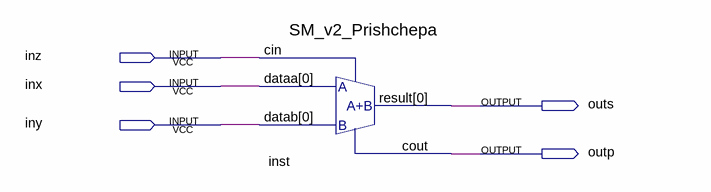
[diagram p0: schematic sheet]
// Quartus schematic SM_2_Prishchepa.bdf as structural Verilog: 1 symbols, 5 pins
module SM_2_Prishchepa (
  input  inz,
  input  inx,
  input  iny,
  output outs,
  output outp
);

  SM_v2_Prishchepa inst (.dataa(inx), .datab(iny), .cin(inz), .result(outs), .cout(outp));
endmodule
